# EAGLE design 6DoF IMU (MPU6050) Module (EAGLE 6.1)
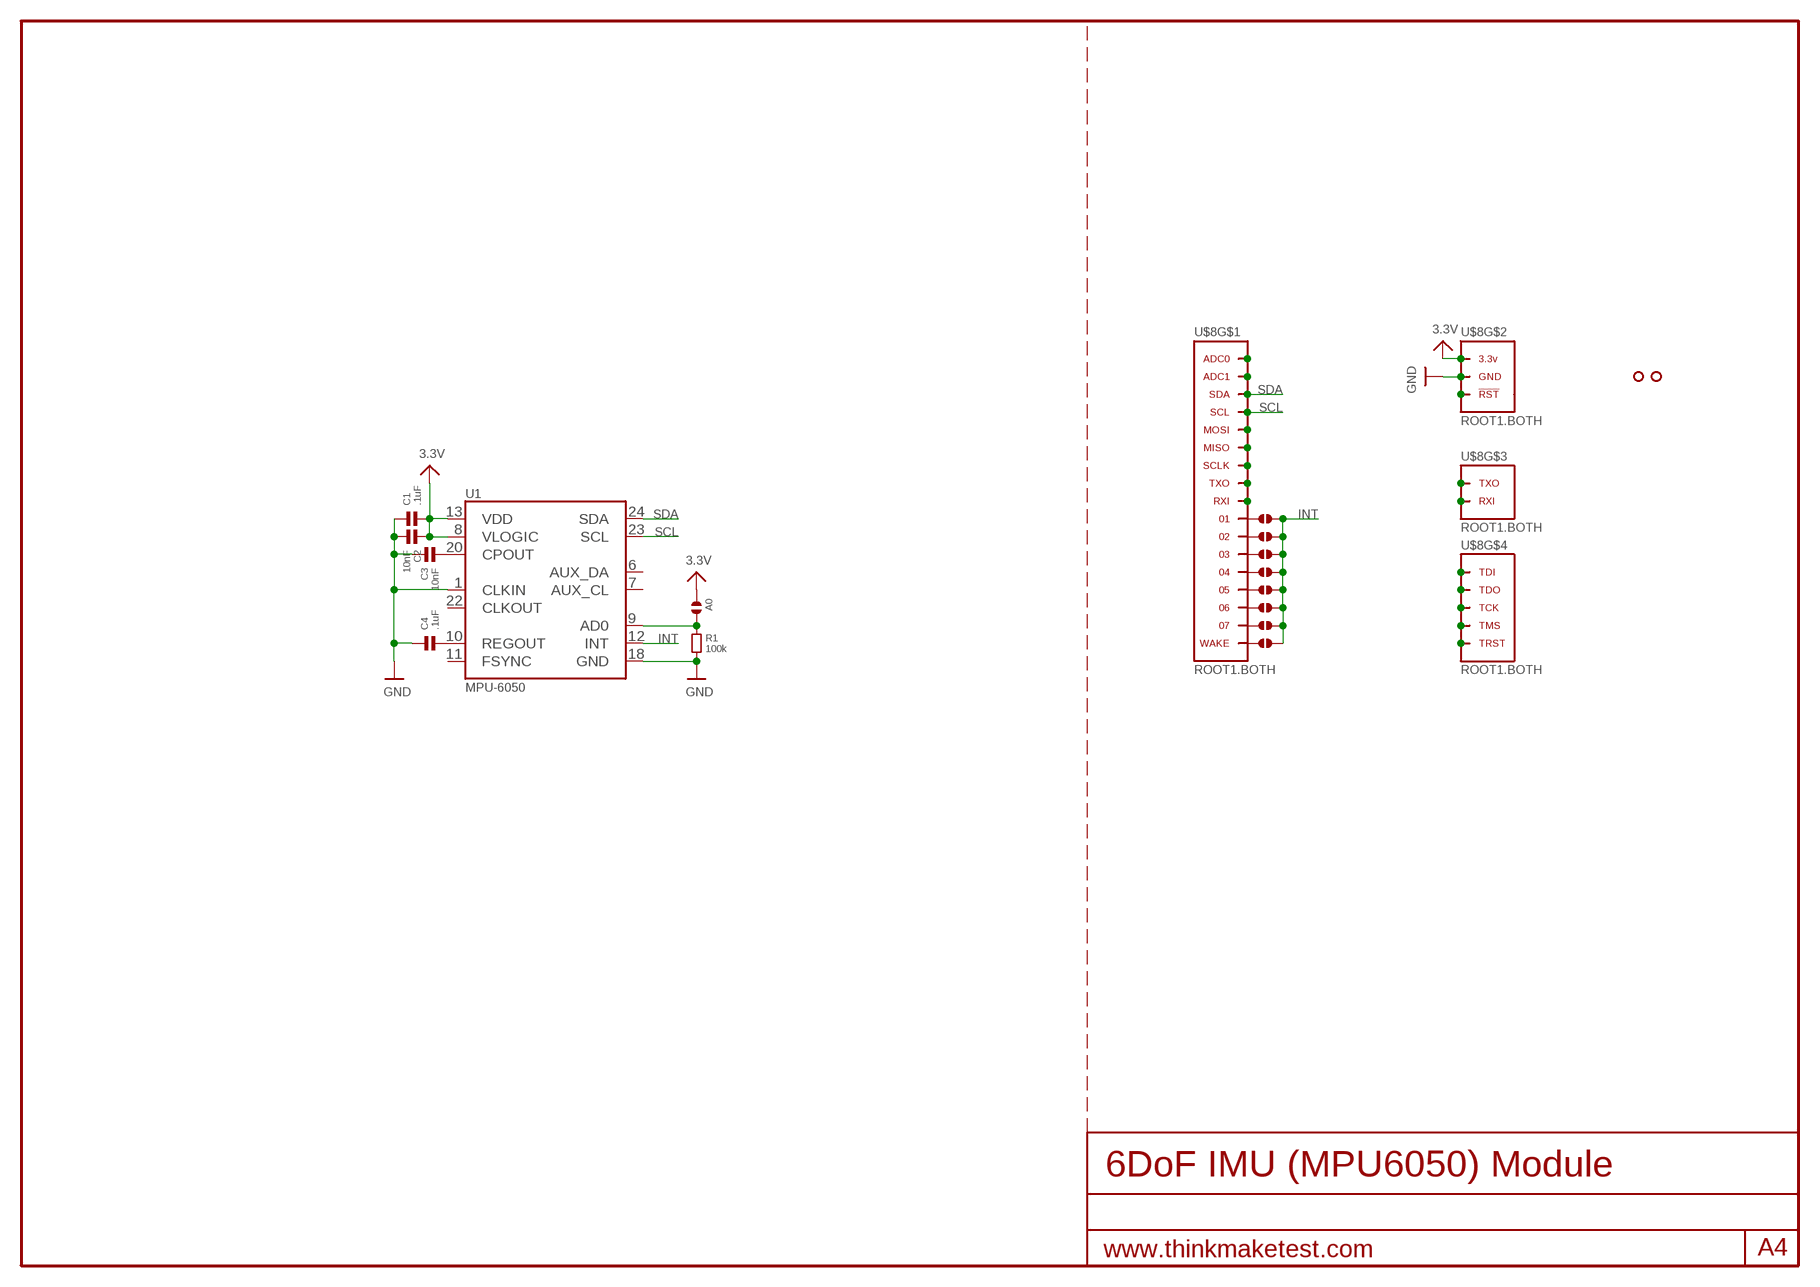
[diagram p0: schematic, sheet 1]

## Parts
A0  SOLDERJUMPER.2.LRG  [2.LRG]
C1  .1uF  CAPACITOR.0603  [0603]
C2  10nF  CAPACITOR.0603  [0603]
C3  10nF  CAPACITOR.0603  [0603]
C4  .1uF  CAPACITOR.0603  [0603]
J1  SOLDERJUMPER.2.SML  [2.SML]
J2  SOLDERJUMPER.2.SML  [2.SML]
J3  SOLDERJUMPER.2.SML  [2.SML]
J4  SOLDERJUMPER.2.SML  [2.SML]
J5  SOLDERJUMPER.2.SML  [2.SML]
J6  SOLDERJUMPER.2.SML  [2.SML]
J7  SOLDERJUMPER.2.SML  [2.SML]
J8  SOLDERJUMPER.2.SML  [2.SML]
R1  100k  RESISTOR.0603  [0603]
U1  MPU-6050  [QFN]
U$3  HOLE.2MM  [2MM]
U$4  HOLE.2MM  [2MM]
U$8  ROOT1.BOTH  [ROOT1.BOTH]

## Nets
3.3V: A0.1 C1.2 C2.1 U1.8(VLOGIC) U1.13(VDD) U$8.3.3V@1(3.3V) U$8.3.3V@2(3.3V) U$8.3.3V@3(3.3V) U$8.3.3V@4(3.3V) U$8.3.3V@5(3.3V) U$8.3.3V@6(3.3V) U$8.3.3V@7(3.3V) U$8.3.3V@8(3.3V) U$8.3.3V@9(3.3V) U$8.3.3V@10(3.3V) U$8.3.3V@11(3.3V) U$8.3.3V@12(3.3V) U$8.3.3V@13(3.3V) U$8.3.3V@14(3.3V) U$8.3.3V@15(3.3V) U$8.3.3V@16(3.3V) U$8.3.3V@17(3.3V) U$8.3.3V@18(3.3V) U$8.3.3V@19(3.3V) U$8.3.3V@20(3.3V) U$8.3.3V@21(3.3V) U$8.3.3V@22(3.3V) U$8.3.3V@23(3.3V) U$8.3.3V@24(3.3V) U$8.3.3V@VIA(3.3V)
GND: C1.1 C2.2 C3.1 C4.1 R1.2 U1.1(CLKIN) U1.18(GND) U$8.GND@1(GND) U$8.GND@2(GND) U$8.GND@3(GND) U$8.GND@4(GND) U$8.GND@5(GND) U$8.GND@6(GND) U$8.GND@7(GND) U$8.GND@8(GND) U$8.GND@9(GND) U$8.GND@10(GND) U$8.GND@11(GND) U$8.GND@12(GND) U$8.GND@13(GND) U$8.GND@14(GND) U$8.GND@15(GND) U$8.GND@16(GND) U$8.GND@17(GND) U$8.GND@18(GND) U$8.GND@19(GND) U$8.GND@20(GND) U$8.GND@21(GND) U$8.GND@22(GND) U$8.GND@23(GND) U$8.GND@24(GND) U$8.GND@25(GND) U$8.GND@26(GND) U$8.GND@VIA(GND)
INT: J1.2 J2.2 J3.2 J4.2 J5.2 J6.2 J7.2 J8.2 U1.12(INT)
N$1: U$8.ADC0 U$8.ADC0@1(ADC0) U$8.ADC0@VIA(ADC0)
N$2: U$8.ADC1 U$8.ADC1@1(ADC1) U$8.ADC1@VIA(ADC1)
N$3: J1.1 U$8.01 U$8.01@1 U$8.01@VIA
N$4: U$8.RST(!RST) U$8.RST@1(!RST) U$8.RST@VIA(!RST)
N$5: U$8.MOSI U$8.MOSI@1(MOSI) U$8.MOSI@VIA(MOSI)
N$6: U$8.MISO U$8.MISO@1(MISO) U$8.MISO@VIA(MISO)
N$7: U$8.SCLK U$8.SCLK@1(SCLK) U$8.SCLK@VIA(SCLK)
N$8: U$8.TXO.DBG(TXO) U$8.TXO.DBG@1(TXO) U$8.TXO.DBG@VIA(TXO)
N$9: U$8.RXI.DBG(RXI) U$8.RXI.DBG@1(RXI) U$8.RXI.DBG@VIA(RXI)
N$10: U$8.TDI U$8.TDI@1(TDI) U$8.TDI@VIA(TDI)
N$11: U$8.TDO U$8.TDO@1(TDO) U$8.TDO@VIA(TDO)
N$12: U$8.TCK U$8.TCK@1(TCK) U$8.TCK@VIA(TCK)
N$13: U$8.RXI U$8.RXI@1(RXI) U$8.RXI@VIA(RXI)
N$14: U$8.TXO U$8.TXO@1(TXO) U$8.TXO@VIA(TXO)
N$15: U$8.TMS U$8.TMS@1(TMS) U$8.TMS@VIA(TMS)
N$16: C3.2 U1.20(CPOUT)
N$17: U$8.TRST U$8.TRST@1(TRST) U$8.TRST@VIA(TRST)
N$18: A0.2 R1.1 U1.9(AD0)
N$19: J2.1 U$8.02 U$8.02@1 U$8.02@VIA
N$20: C4.2 U1.10(REGOUT)
N$21: J3.1 U$8.03 U$8.03@1 U$8.03@VIA
N$22: J4.1 U$8.04 U$8.04@1 U$8.04@VIA
N$23: J5.1 U$8.05 U$8.05@1 U$8.05@VIA
N$24: J6.1 U$8.06 U$8.06@1 U$8.06@VIA
N$25: J7.1 U$8.07 U$8.07@1 U$8.07@VIA
N$26: J8.1 U$8.WAKE U$8.WAKE@1(WAKE) U$8.WAKE@VIA(WAKE)
SCL: U1.23(SCL) U$8.SCL U$8.SCL@1(SCL) U$8.SCL@VIA(SCL)
SDA: U1.24(SDA) U$8.SDA U$8.SDA@1(SDA) U$8.SDA@VIA(SDA)
Unconnected: U1.6(AUX_DA) U1.7(AUX_CL) U1.11(FSYNC) U1.22(CLKOUT)

## Library data of the parts
A0 J1-J8 = .solderjumper:SOLDERJUMPER.2
C1-C4 = .standardparts:CAPACITOR
R1 = .standardparts:RESISTOR
U1 = invensense:MPU-6050
U$3 U$4 = .screw_holes:HOLE
U$8 = thinkmaketest:ROOT1

## Board
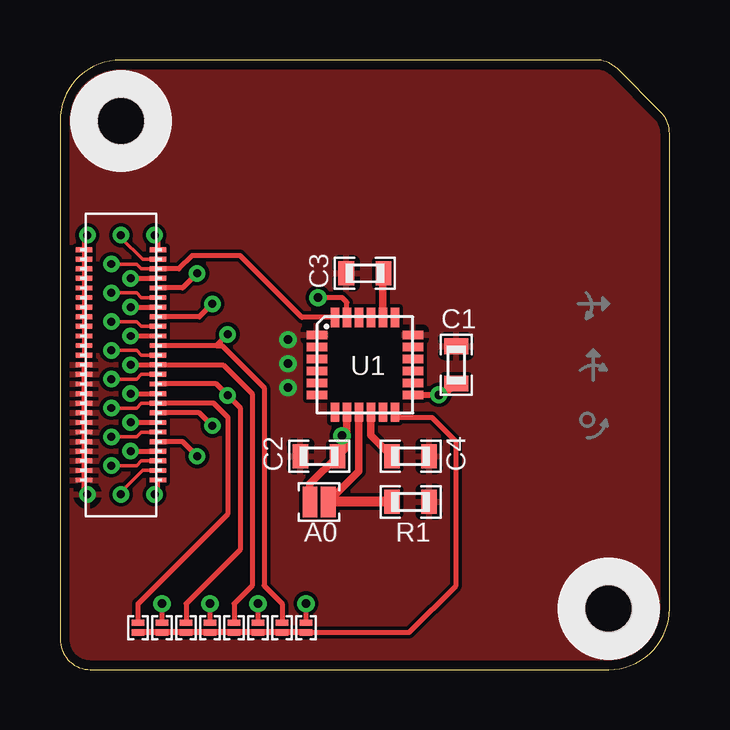
[diagram p1: board, top side]
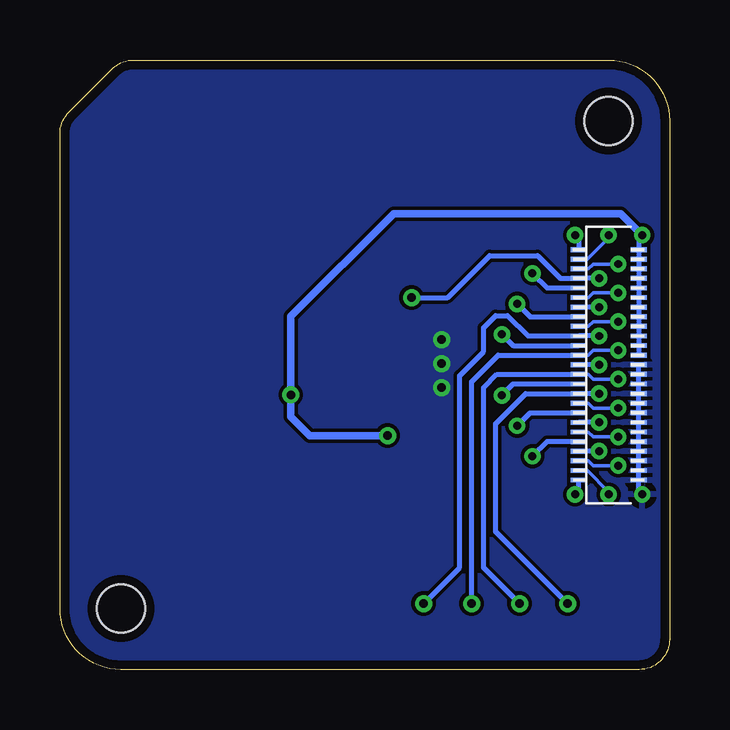
[diagram p2: board, bottom side, seen from below]

Size 25.4 x 25.4 mm. Coordinates in mm from the lower left corner, seen from the top.
Outline: 0,22.86 0,1.27 arc90 1.27,0 22.86,0 arc90 25.4,2.54 25.4,22.33 arc45 25.03,23.23 23.23,25.03 arc45 22.33,25.4 2.54,25.4 arc90 0,22.86
Copper layers (1*16): Top 0.0356mm / dielectric 1.5011mm / Bottom 0.0356mm
Design rules "default": minimum track width 6mil, minimum drill 13mil, track to track 6mil, track to pad 6mil, pad to pad 6mil, via to via 6mil, smd to smd 6mil, copper to edge 15mil, drill to drill 6mil, minimum pad ring 7mil, minimum via ring 7mil, stop-mask expansion 4mil, vias tented up to drill 16mil, thermal gap 10mil

### Footprints (pad centres in the part's own frame; a part is rotated, then mirrored left to right if it is on the bottom)
2.LRG = smd 0.61 x 1.27: 1 -0.381,0; 2 0.381,0
0603 = smd 0.65 x 1: 1 -0.775,0; 2 0.775,0
2.SML = smd 0.254 x 0.508: 1 -0.203,0; 2 0.203,0
QFN = smd 0.85 x 0.35: 1 -2,1.25; 2 -2,0.75; 3 -2,0.25; 4 -2,-0.25; 5 -2,-0.75; 6 -2,-1.25; 13 2,-1.25; 14 2,-0.75; 15 2,-0.25; 16 2,0.25; 17 2,0.75; 18 2,1.25 | smd 0.35 x 0.8: 7 -1.25,-1.975; 8 -0.75,-1.975; 9 -0.25,-1.975; 10 0.25,-1.975; 11 0.75,-1.975; 12 1.25,-1.975; 19 1.25,1.975; 20 0.75,1.975; 21 0.25,1.975; 22 -0.25,1.975; 23 -0.75,1.975; 24 -1.25,1.975
2MM = hole 2: 0,0
ROOT1.BOTH = smd 0.66 x 0.2 bottom: 01 3.795,13.9; 02 3.795,13.5; 03 3.795,13.1; 3.3V@1 1.285,17.5; 3.3V@2 1.285,17.1; 3.3V@3 1.285,16.7; 3.3V@4 1.285,16.3; 3.3V@5 1.285,15.9; 3.3V@6 1.285,15.5; 3.3V@7 1.285,15.1; 3.3V@8 1.285,14.7; 3.3V@9 1.285,14.3; 3.3V@10 1.285,13.9; 3.3V@11 1.285,13.5; 3.3V@12 1.285,13.1; 04 3.795,12.7; 05 3.795,12.3; 06 3.795,11.9; 07 3.795,11.5; ADC0 3.795,17.5; ADC1 3.795,17.1; GND@1 1.285,7.9; GND@2 1.285,8.3; GND@3 1.285,8.7; GND@4 1.285,9.1; GND@5 1.285,9.5; GND@6 1.285,9.9; GND@7 1.285,10.3; GND@8 1.285,10.7; GND@9 1.285,11.1; GND@10 1.285,11.5; GND@11 1.285,11.9; GND@12 1.285,12.3; GND@13 1.285,12.7; MISO 3.795,15.5; MOSI 3.795,15.9; RST 3.795,7.9; RXI 3.795,14.3; RXI.DBG 3.795,10.3; SCL 3.795,16.3; SCLK 3.795,15.1; SDA 3.795,16.7; TCK 3.795,9.1; TDI 3.795,9.9; TDO 3.795,9.5; TMS 3.795,8.7; TRST 3.795,8.3; TXO 3.795,14.7; TXO.DBG 3.795,10.7; WAKE 3.795,11.1 | smd 0.7 x 0.2: 01@1 4.08,13.9; 02@1 4.08,13.5; 3.3V@13 1,17.5; 3.3V@14 1,17.1; 3.3V@15 1,16.7; 3.3V@16 1,16.3; 3.3V@17 1,15.9; 3.3V@18 1,15.5; 3.3V@19 1,15.1; 3.3V@20 1,14.7; 3.3V@21 1,14.3; 3.3V@22 1,13.9; 3.3V@23 1,13.5; 3.3V@24 1,13.1; 03@1 4.08,13.1; 04@1 4.08,12.7; 05@1 4.08,12.3; 06@1 4.08,11.9; 07@1 4.08,11.5; ADC0@1 4.08,17.5; ADC1@1 4.08,17.1; GND@14 1,7.9; GND@15 1,8.3; GND@16 1,8.7; GND@17 1,9.1; GND@18 1,9.5; GND@19 1,9.9; GND@20 1,10.3; GND@21 1,10.7; GND@22 1,11.1; GND@23 1,11.5; GND@24 1,11.9; GND@25 1,12.3; GND@26 1,12.7; MISO@1 4.08,15.5; MOSI@1 4.08,15.9; RST@1 4.08,7.9; RXI.DBG@1 4.08,10.3; RXI@1 4.08,14.3; SCL@1 4.08,16.3; SCLK@1 4.08,15.1; SDA@1 4.08,16.7; TCK@1 4.08,9.1; TDI@1 4.08,9.9; TDO@1 4.08,9.5; TMS@1 4.08,8.7; TRST@1 4.08,8.3; TXO.DBG@1 4.08,10.7; TXO@1 4.08,14.7; WAKE@1 4.08,11.1 | drill 0.33 pad 0.686: 01@VIA 2.94,13.9; 02@VIA 6.985,13.97; 3.3V@VIA 1.14,18.1; 03@VIA 2.14,13.3; 04@VIA 2.94,12.7; 05@VIA 2.14,12.1; 06@VIA 6.985,11.43; 07@VIA 2.94,11.5; ADC0@VIA 3.94,18.1; ADC1@VIA 2.54,18.1; GND@VIA 1.14,7.3; MISO@VIA 2.14,15.7; MOSI@VIA 5.715,16.51; RST@VIA 3.94,7.3; RXI.DBG@VIA 2.94,10.3; RXI@VIA 2.14,14.5; SCL@VIA 2.94,16.3; SCLK@VIA 2.94,15.1; SDA@VIA 2.14,16.9; TCK@VIA 2.94,9.1; TDI@VIA 2.14,9.7; TDO@VIA 5.715,8.89; TMS@VIA 2.14,8.5; TRST@VIA 2.54,7.3; TXO.DBG@VIA 6.35,10.16; TXO@VIA 6.35,15.24; WAKE@VIA 2.14,10.9

### Placement (x,y rotation side)
A0  10.79,6.99 0 top
C1  16.51,12.7 270 top
C2  10.79,8.89 180 top
C3  12.7,16.51 0 top
C4  14.61,8.89 180 top
J1  10.25,1.75 270 top
J2  9.25,1.75 270 top
J3  8.25,1.75 270 top
J4  7.25,1.75 270 top
J5  6.25,1.75 270 top
J6  5.25,1.75 270 top
J7  4.25,1.75 270 top
J8  3.25,1.75 270 top
R1  14.61,6.99 0 top
U1  12.7,12.7 0 top
U$3  22.86,2.54 90 top
U$4  2.54,22.86 90 top
U$8  0,0 0 top

### Tracks (layer width: path | path; a pad name or v marks a point on that pad's centre or on a via)
3.3V  (via drill 0.36)
  Top 0.254: U1.13 v15.79,11.45 16.04,11.45 C1.2
  Top 0.305: U1.8 11.95,9.75 | 11.95,9.75 11.95,9.27 C2.1 10.41,7.73 A0.1 | v11.75,9.75 11.95,9.75
  Bottom 0.305: U$8.3.3V@VIA 2.04,19 11.5,19 15.79,14.71 v15.79,11.45 15.79,10.54 15,9.75 v11.75,9.75
GND  (via drill 0.36)
  other vias: 9.5,13.75 9.5,12.75 9.5,11.75
  pour Bottom (rank 6): 0,0 25.4,0 25.4,25.4 0,25.4
  pour Top (rank 6): 0,0 25.4,0 25.4,25.4 0,25.4
INT
  Top 0.203: J1.2 14.55,1.55 16.5,3.5 16.5,9.5 15.5,10.5 14.18,10.5 U1.12
  Top 0.254: J8.2 J7.2 J6.2 J5.2 J4.2 J3.2 J2.2 J1.2
N$3  (via drill 0.36)
  Top 0.203: J1.1 v10.25,2.75
  Bottom 0.203: v10.25,2.75 8.75,4.25 8.75,12.25 7.75,13.25 7.75,14.25 7.25,14.75 6.75,14.75 5.9,13.9 U$8.01
N$16
  Top 0.305: U1.20 13.45,16.48 C3.2
N$18
  Top 0.305: U1.9 12.45,8.26 A0.2
  Top 0.406: R1.1 A0.2
N$19
  Top 0.203: 6.51,13.5 6.75,13.5 8.5,11.75 8.5,3.5 9.25,2.75 J2.1
N$20
  Top 0.305: U1.10 12.95,9.77 C4.2
N$21  (via drill 0.36)
  Top 0.203: J3.1 v8.25,2.75
  Bottom 0.203: v8.25,2.75 8.25,12 7.15,13.1 U$8.03
N$22
  Top 0.203: U$8.04@1 6.8,12.7 8,11.5 8,3.5 7.25,2.75 J4.1
N$23  (via drill 0.36)
  Top 0.203: J5.1 v6.25,2.75
  Bottom 0.203: v6.25,2.75 7.75,4.25 7.75,11.75 7.2,12.3 U$8.05
N$24
  Top 0.203: U$8.06@VIA 7.5,10.91 7.5,5 5.25,2.75 J6.1
N$25  (via drill 0.36)
  Top 0.203: J7.1 v4.25,2.75
  Bottom 0.203: v4.25,2.75 7.25,5.75 7.25,10.25 6,11.5 U$8.07
N$26
  Top 0.203: J8.1 3.25,2.75 7,6.5 7,10.5 6.4,11.1 U$8.WAKE@1
SCL  (via drill 0.36)
  Top 0.203: U1.23 11.95,15.3 11.75,15.5 v10.75,15.5
  Bottom 0.203: v10.75,15.5 9.25,15.5 7.5,17.25 5.5,17.25 4.55,16.3 U$8.SCL
SDA
  Top 0.203: U1.24 10.07,14.68 7.5,17.25 5.5,17.25 4.95,16.7 U$8.SDA@1

### Text on the board
tDocu: X | Y | Z | INT
bDocu: Cruz Monrreal II | v1 | InnovativeMaker.com